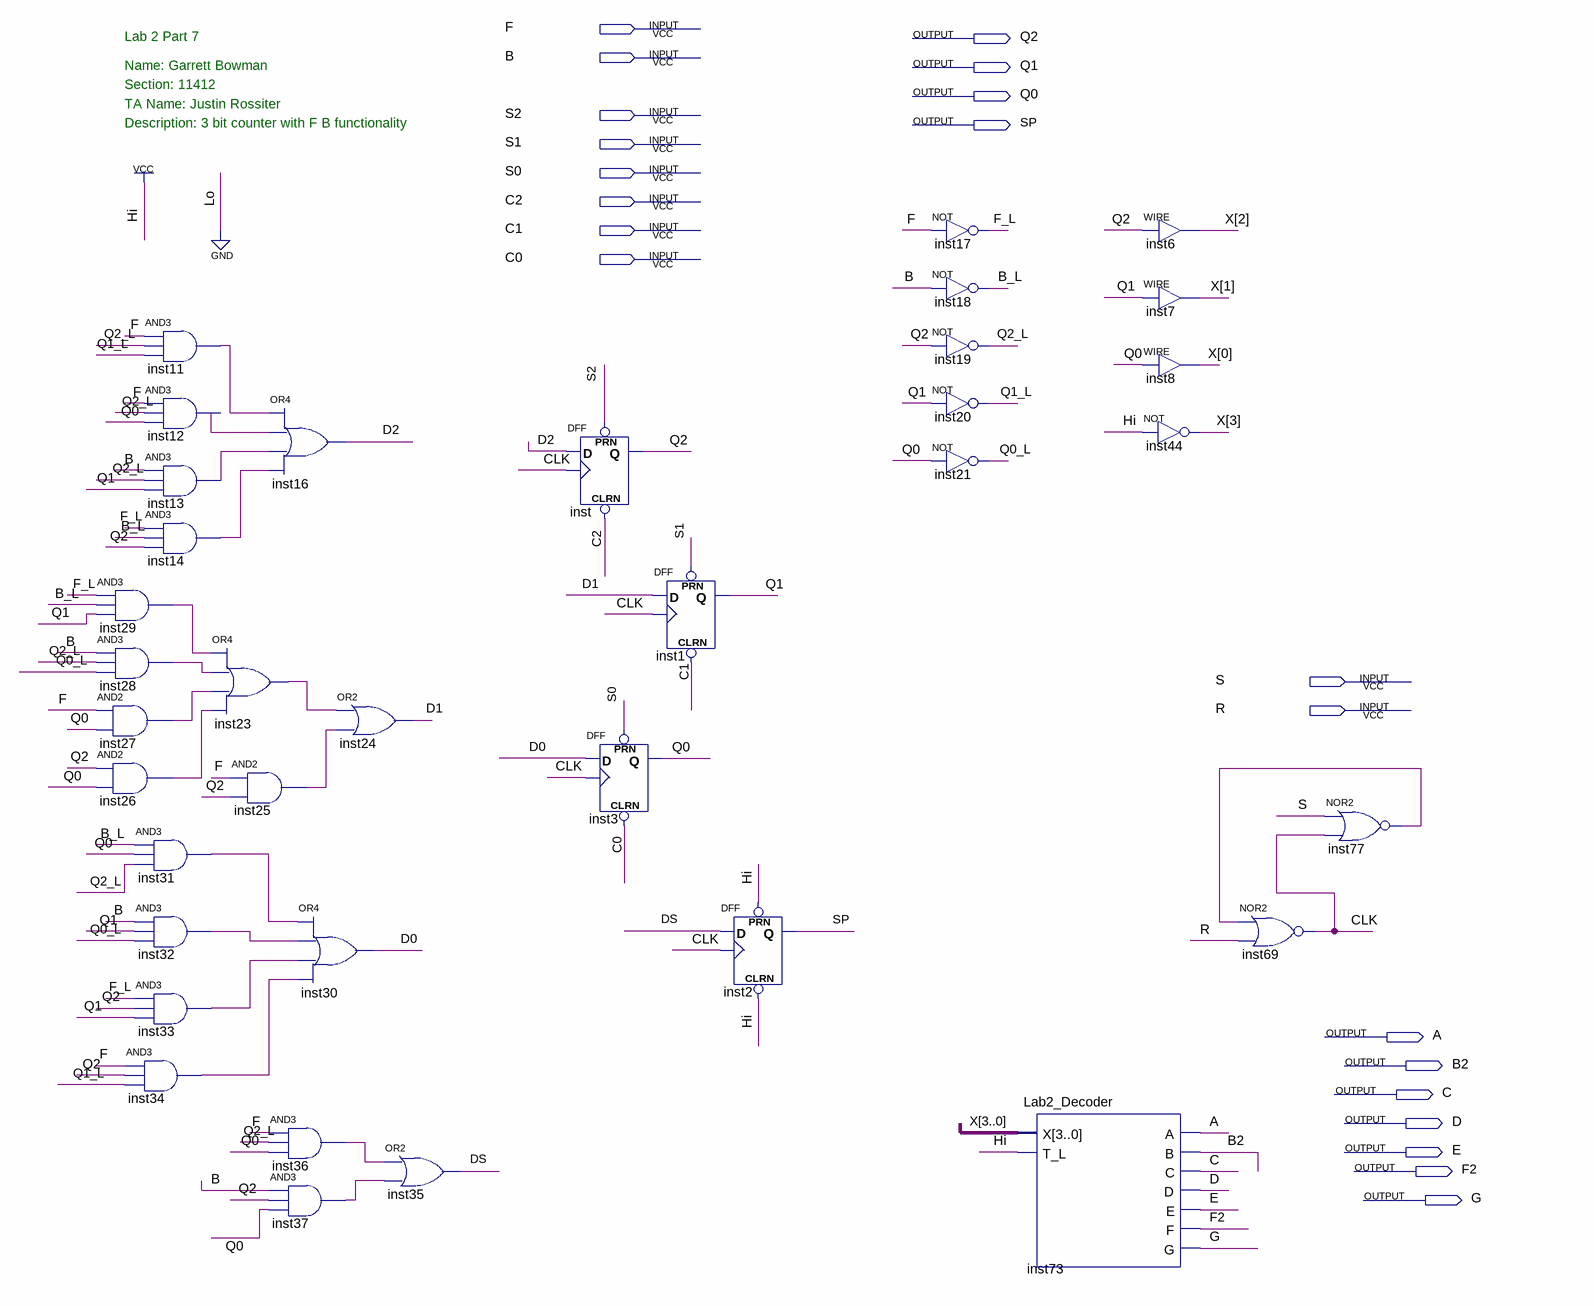
[diagram p0: schematic sheet]
// Quartus schematic Lab3_3bit_Cnt.bdf as structural Verilog: 36 symbols, 21 pins
module Lab3_3bit_Cnt (
  input  F,
  input  B,
  input  S2,
  input  S1,
  input  S0,
  input  C2,
  input  C1,
  input  C0,
  input  S,
  input  R,
  output Q2,
  output Q1,
  output Q0,
  output SP,
  output A,
  output B2,
  output C,
  output D,
  output E,
  output F2,
  output G
);

  wire B_L, CLK, D0, D1, D2, DS, F_L, inst11_out, inst12_out, inst13_out, inst14_out, inst23_out, inst25_out,
       inst26_out, inst27_out, inst28_out, inst29_out, inst31_out, inst32_out, inst33_out, inst34_out,
       inst36_out, inst37_out, inst77_out, Q0_L, Q1_L, Q2_L;
  wire [3:0] X;

  and inst29 (inst29_out, F_L, B_L, Q1);
  and inst28 (inst28_out, B, Q2_L, Q0_L);
  and inst27 (inst27_out, F, Q0);
  and inst26 (inst26_out, Q2, Q0);
  and inst11 (inst11_out, F, Q2_L, Q1_L);
  and inst12 (inst12_out, F, Q2_L, Q0);
  and inst13 (inst13_out, B, Q2_L, Q1);
  and inst14 (inst14_out, F_L, B_L, Q2);
  and inst31 (inst31_out, B_L, Q0, Q2_L);
  and inst32 (inst32_out, B, Q1, Q0_L);
  and inst33 (inst33_out, F_L, Q2, Q1);
  and inst34 (inst34_out, F, Q2, Q1_L);
  or inst23 (inst23_out, inst29_out, inst28_out, inst27_out, inst26_out);
  and inst25 (inst25_out, F, Q2);
  or inst16 (D2, inst11_out, inst12_out, inst13_out, inst14_out);
  or inst30 (D0, inst31_out, inst32_out, inst33_out, inst34_out);
  and inst36 (inst36_out, F, Q2_L, Q0);
  and inst37 (inst37_out, B, Q2, Q0);
  or inst24 (D1, inst23_out, inst25_out);
  or inst35 (DS, inst36_out, inst37_out);
  DFF inst (.CLRN(C2), .CLK(CLK), .D(D2), .PRN(S2), .Q(Q2));
  DFF inst3 (.CLRN(C0), .CLK(CLK), .D(D0), .PRN(S0), .Q(Q0));
  DFF inst1 (.CLRN(C1), .CLK(CLK), .D(D1), .PRN(S1), .Q(Q1));
  DFF inst2 (.CLRN(1'b1), .CLK(CLK), .D(DS), .PRN(1'b1), .Q(SP));
  not inst17 (F_L, F);
  not inst18 (B_L, B);
  not inst19 (Q2_L, Q2);
  not inst20 (Q1_L, Q1);
  not inst21 (Q0_L, Q0);
  Lab2_Decoder inst73 (.X(X), .T_L(1'b1), .A(A), .B(B2), .C(C), .D(D), .E(E), .F(F2), .G(G));
  assign X[2] = Q2;  // WIRE inst6
  assign X[1] = Q1;  // WIRE inst7
  assign X[0] = Q0;  // WIRE inst8
  not inst44 (X[3], 1'b1);
  nor inst69 (CLK, inst77_out, R);
  nor inst77 (inst77_out, S, CLK);

  // Notes on the sheet:
  //   Lab 2 Part 7
  //   Name: Garrett Bowman
  //   Section: 11412
  //   TA Name: Justin Rossiter
  //   Description: 3 bit counter with F B functionality
endmodule
